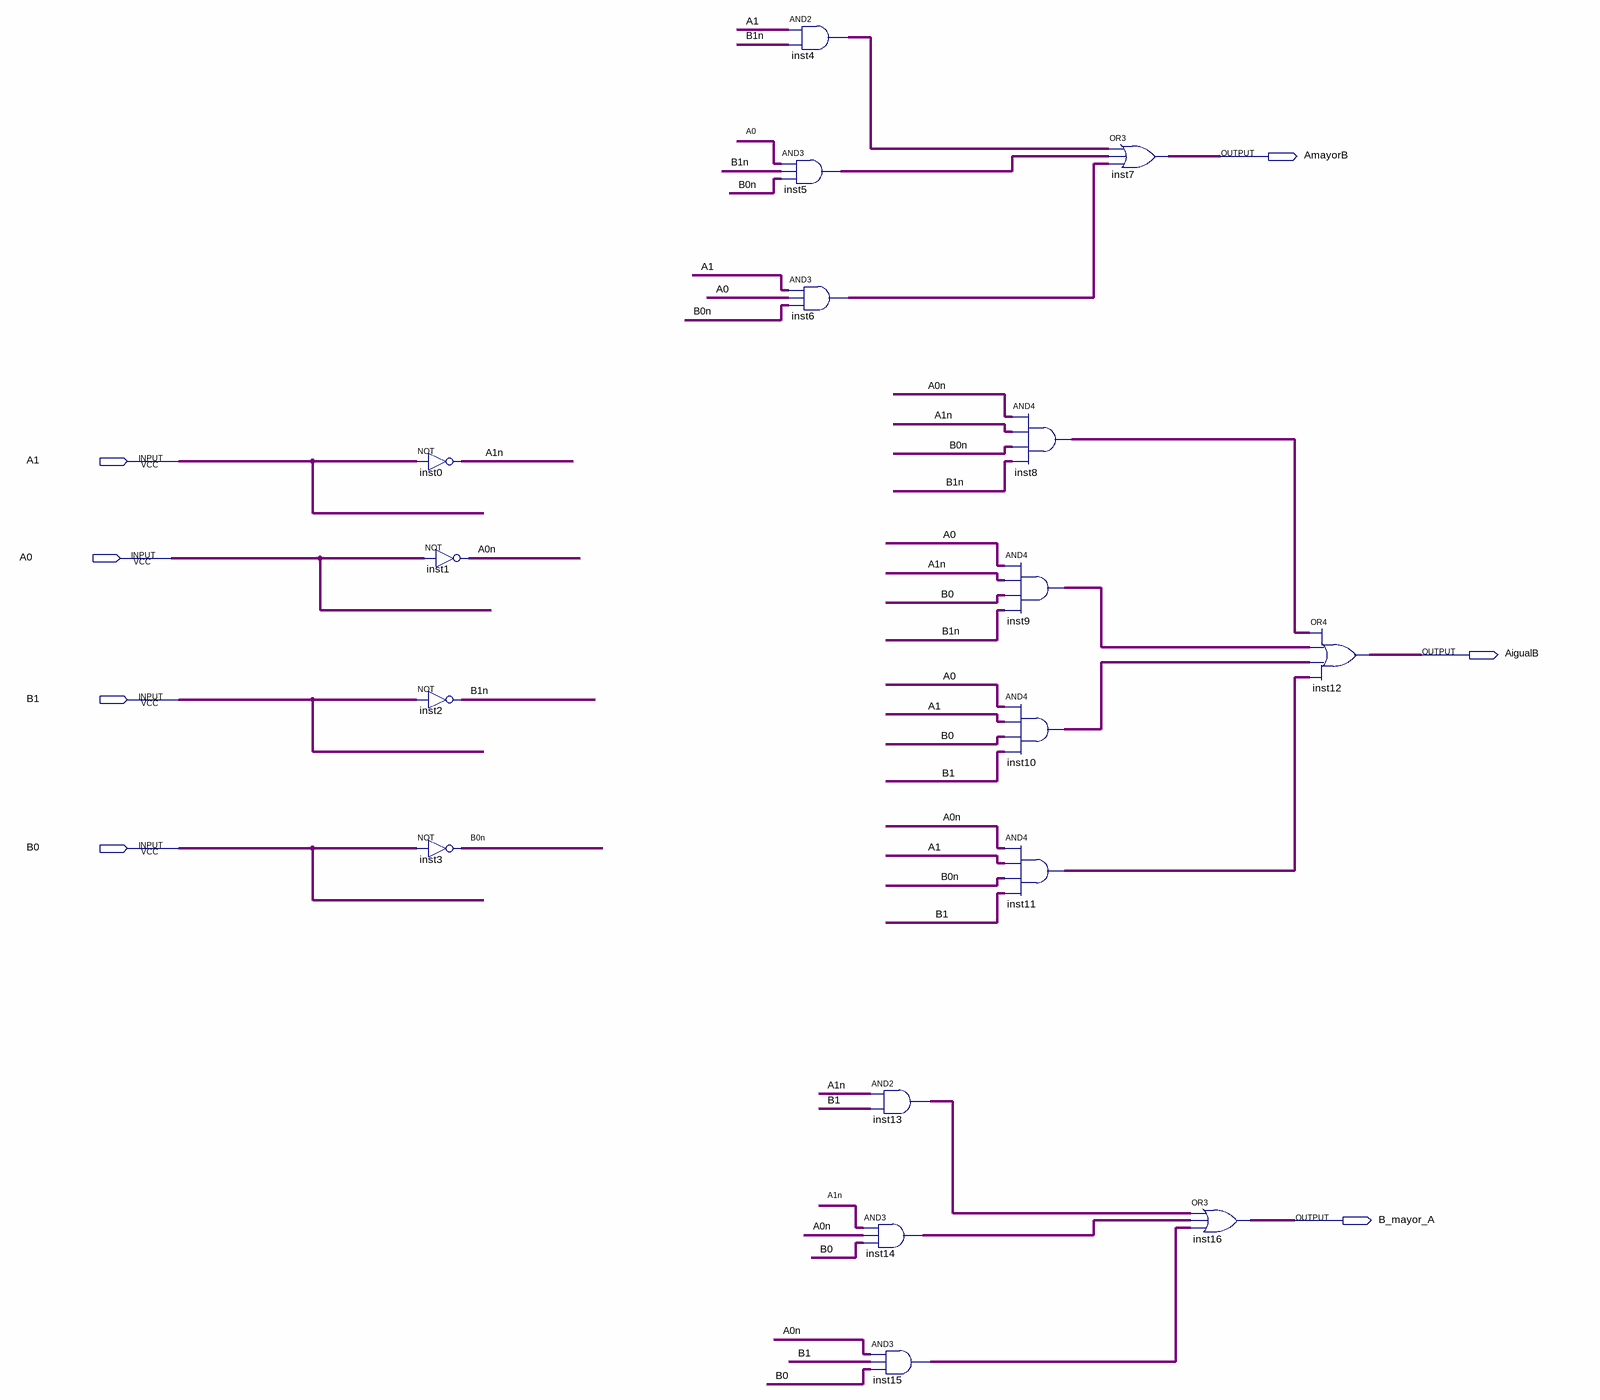
[diagram p0: schematic sheet]
// Quartus schematic Comparador.bdf as structural Verilog: 17 symbols, 7 pins
module Comparador (
  input  A1,
  input  A0,
  input  B1,
  input  B0,
  output AmayorB,
  output AigualB,
  output B_mayor_A
);

  wire A0n, A1n, B0n, B1n, inst4_out, inst5_out, inst6_out, inst8_out, inst9_out, inst10_out, inst11_out,
       inst13_out, inst14_out, inst15_out;

  not inst0 (A1n, A1);
  not inst1 (A0n, A0);
  not inst2 (B1n, B1);
  not inst3 (B0n, B0);
  and inst4 (inst4_out, A1, B1n);
  and inst5 (inst5_out, A0, B1n, B0n);
  and inst6 (inst6_out, A1, A0, B0n);
  and inst13 (inst13_out, A1n, B1);
  and inst14 (inst14_out, A1n, A0n, B0);
  and inst15 (inst15_out, A0n, B1, B0);
  and inst9 (inst9_out, A0, A1n, B0, B1n);
  and inst10 (inst10_out, A0, A1, B0, B1);
  and inst11 (inst11_out, A0n, A1, B0n, B1);
  and inst8 (inst8_out, A0n, A1n, B0n, B1n);
  or inst7 (AmayorB, inst4_out, inst5_out, inst6_out);
  or inst16 (B_mayor_A, inst13_out, inst14_out, inst15_out);
  or inst12 (AigualB, inst8_out, inst9_out, inst10_out, inst11_out);
endmodule
